# EAGLE design Swbot_shield (EAGLE 6.3)
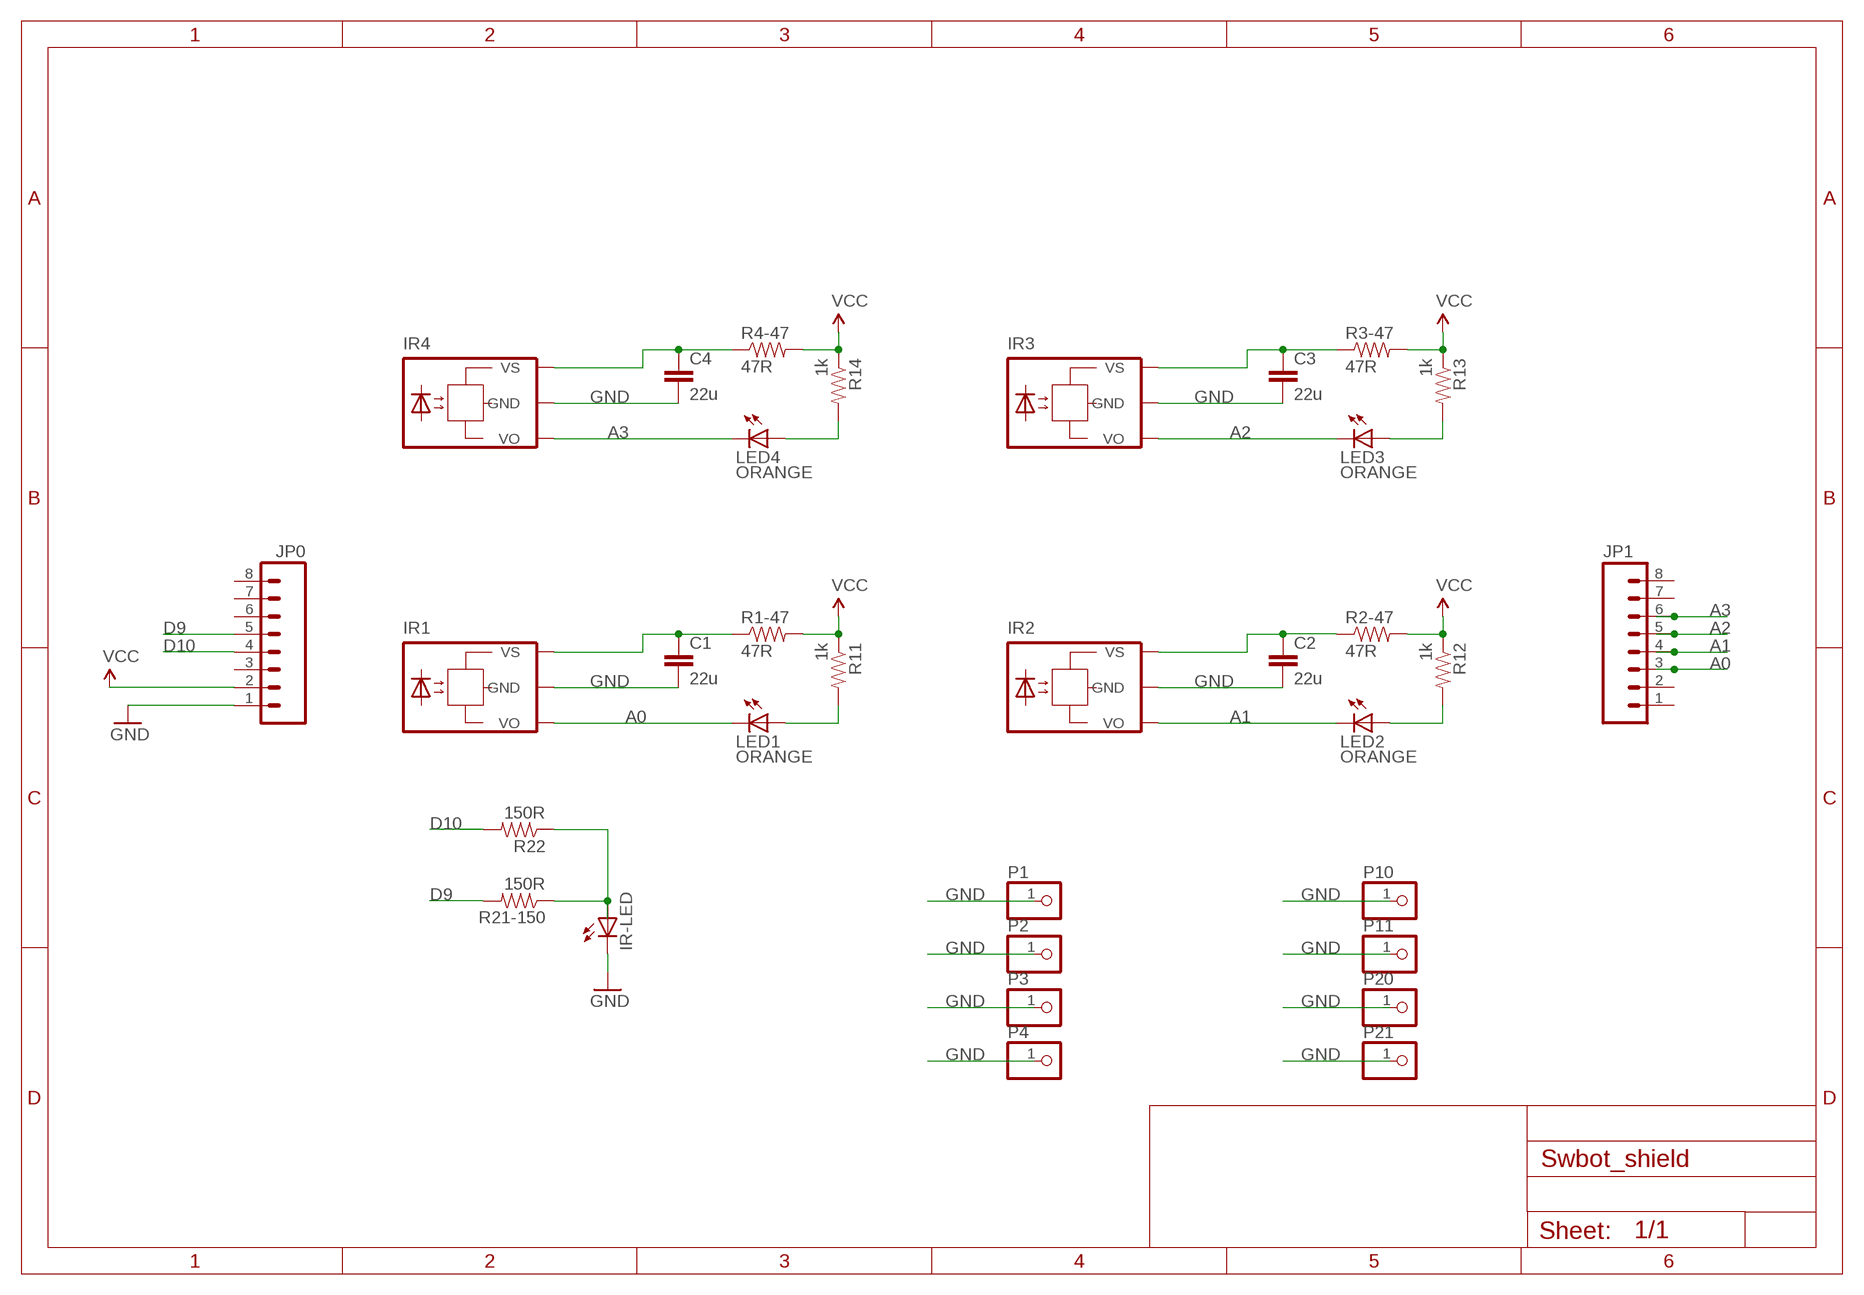
[diagram p0: schematic, sheet 1]

## Parts
C1  22u  CAP1206  [1206]
C2  22u  CAP1206  [1206]
C3  22u  CAP1206  [1206]
C4  22u  CAP1206  [1206]
IR1  -NJL  [TSOP]
IR2  -NJL  [TSOP]
IR3  -NJL  [TSOP]
IR4  -NJL  [TSOP]
IR-LED  LED5MM  [LED5MM]
JP0  M08LOCK  [1X08_LOCK]
JP1  M08LOCK  [1X08_LOCK]
LED1  ORANGE  LEDCHIPLED_0805  [CHIPLED_0805]
LED2  ORANGE  LEDCHIPLED_0805  [CHIPLED_0805]
LED3  ORANGE  LEDCHIPLED_0805  [CHIPLED_0805]
LED4  ORANGE  LEDCHIPLED_0805  [CHIPLED_0805]
P1  PINHD-1X1  [1X01]
P2  PINHD-1X1  [1X01]
P3  PINHD-1X1  [1X01]
P4  PINHD-1X1  [1X01]
P10  PINHD-1X1  [1X01]
P11  PINHD-1X1  [1X01]
P20  PINHD-1X1  [1X01]
P21  PINHD-1X1  [1X01]
R1-47  47R  RESISTOR0805-RES  [0805]
R2-47  47R  RESISTOR0805-RES  [0805]
R3-47  47R  RESISTOR0805-RES  [0805]
R4-47  47R  RESISTOR0805-RES  [0805]
R11  1k  RESISTOR0805-RES  [0805]
R12  1k  RESISTOR0805-RES  [0805]
R13  1k  RESISTOR0805-RES  [0805]
R14  1k  RESISTOR0805-RES  [0805]
R21-150  150R  RESISTOR0805-RES  [0805]
R22  150R  RESISTOR0805-RES  [0805]

## Nets
A0: IR1.VO JP1.3 LED1.C
A1: IR2.VO JP1.4 LED2.C
A2: IR3.VO JP1.5 LED3.C
A3: IR4.VO JP1.6 LED4.C
D9: JP0.5 R21-150.2
D10: JP0.4 R22.2
GND [vcc]: C1.2 C2.2 C3.2 C4.2 IR1.GND IR2.GND IR3.GND IR4.GND IR-LED.K(C) JP0.1 P1.1 P2.1 P3.1 P4.1 P10.1 P11.1 P20.1 P21.1
N$1: LED1.A R11.2
N$2: IR-LED.A R21-150.1 R22.1
N$4: LED2.A R12.2
N$6: LED3.A R13.2
N$7 [vcc]: C2.1 IR2.VCC(VS) R2-47.1
N$8: LED4.A R14.2
N$9 [vcc]: C4.1 IR4.VCC(VS) R4-47.1
N$10 [vcc]: C3.1 IR3.VCC(VS) R3-47.1
N$11 [vcc]: C1.1 IR1.VCC(VS) R1-47.1
VCC [vcc]: JP0.2 R1-47.2 R2-47.2 R3-47.2 R4-47.2 R11.1 R12.1 R13.1 R14.1
Unconnected: JP0.3 JP0.6 JP0.7 JP0.8 JP1.1 JP1.2 JP1.7 JP1.8

## Library data of the parts
C1-C4 = SparkFun-Passives:CAP: Capacitor Standard 0603 ceramic capacitor, and 0.1" leaded capacitor.
IR1-IR4 = LeoBuild:?-NJL*
IR-LED = SparkFun-LED:LED: LEDs Standard schematic elements and footprints for 5mm, 3mm, 1206, and 0603 sized LEDs. 5mm - Spark Fun Electronics SKU : COM-00529 (and others)
JP0 JP1 = SparkFun-Connectors:M08: Header 8 Standard 8-pin 0.1" header. Use with straight break away headers (SKU : PRT-00116), right angle break away headers (PRT-00553), swiss pins (PRT-00743), machine pins (PRT-00117), and female headers (PRT-00115).
LED1-LED4 = led:LED: LED OSRAM: - CHIPLED LG R971, LG N971, LY N971, LG Q971, LY Q971, LO R971, LY R971 LH N974, LH R974 LS Q976, LO Q976, LY Q976 LO Q996 - Hyper CHIPLED LW Q18S LB Q993, LB Q99A, LB R99A - SideLED LS A670, LO A670, LY A670, LG A670, LP A670 LB A673, LV A673, LT A673, LW A673 LH A674 LY A675 LS A676, LA A676, LO A676, LY A676, LW A676 LS A679, LY A679, LG A679 - Hyper Micro SIDELED® LS Y876, LA Y876, LO Y876, LY Y876 LT Y87S - SmartLED LW L88C, LW L88S LB L89C, LB L89S, LG L890 LS L89K, LO L89K, LY L89K LS L896, LA L896, LO L896, LY L896 - TOPLED LS T670, LO T670, LY T670, LG T670, LP T670 LSG T670, LSP T670, LSY T670, LOP T670, LYG T670 LG T671, LOG T671, LSG T671 LB T673, LV T673, LT T673, LW T673 LH T674 LS T676, LA T676, LO T676, LY T676, LB T676, LH T676, LSB T676, LW T676 LB T67C, LV T67C, LT T67C, LS T67K, LO T67K, LY T67K, LW E67C LS E67B, LA E67B, LO E67B, LY E67B, LB E67C, LV E67C, LT E67C LW T67C LS T679, LY T679, LG T679 LS T770, LO T770, LY T770, LG T770, LP T770 LB T773, LV T773, LT T773, LW T773 LH T774 LS E675, LA E675, LY E675, LS T675 LS T776, LA T776, LO T776, LY T776, LB T776 LHGB T686 LT T68C, LB T68C - Hyper Mini TOPLED® LB M676 - Mini TOPLED Santana® LG M470 LS M47K, LO M47K, LY M47K Source: http://www.osram.convergy.de LUXEON: - LUMILED® LXK2-PW12-R00, LXK2-PW12-S00, LXK2-PW14-U00, LXK2-PW14-V00 LXK2-PM12-R00, LXK2-PM12-S00, LXK2-PM14-U00 LXK2-PE12-Q00, LXK2-PE12-R00, LXK2-PE12-S00, LXK2-PE14-T00, LXK2-PE14-U00 LXK2-PB12-K00, LXK2-PB12-L00, LXK2-PB12-M00, LXK2-PB14-N00, LXK2-PB14-P00, LXK2-PB14-Q00 LXK2-PR12-L00, LXK2-PR12-M00, LXK2-PR14-Q00, LXK2-PR14-R00 LXK2-PD12-Q00, LXK2-PD12-R00, LXK2-PD12-S00 LXK2-PH12-R00, LXK2-PH12-S00 LXK2-PL12-P00, LXK2-PL12-Q00, LXK2-PL12-R00 Source: www.luxeon.com KINGBRIGHT: KA-3528ASYC Source: www.kingbright.com
P1-P4 P10 P11 P20 P21 = pinhead:PINHD-1X1: PIN HEADER
R1-47 R2-47 R3-47 R4-47 R11-R14 R21-150 R22 = SparkFun-Resistors:RESISTOR: Resistor Basic schematic elements and footprints for 0603, 1206, and PTH resistors.

## Net classes
0 default: width 0.254 mm
1 vcc: width 0.406 mm

## Board
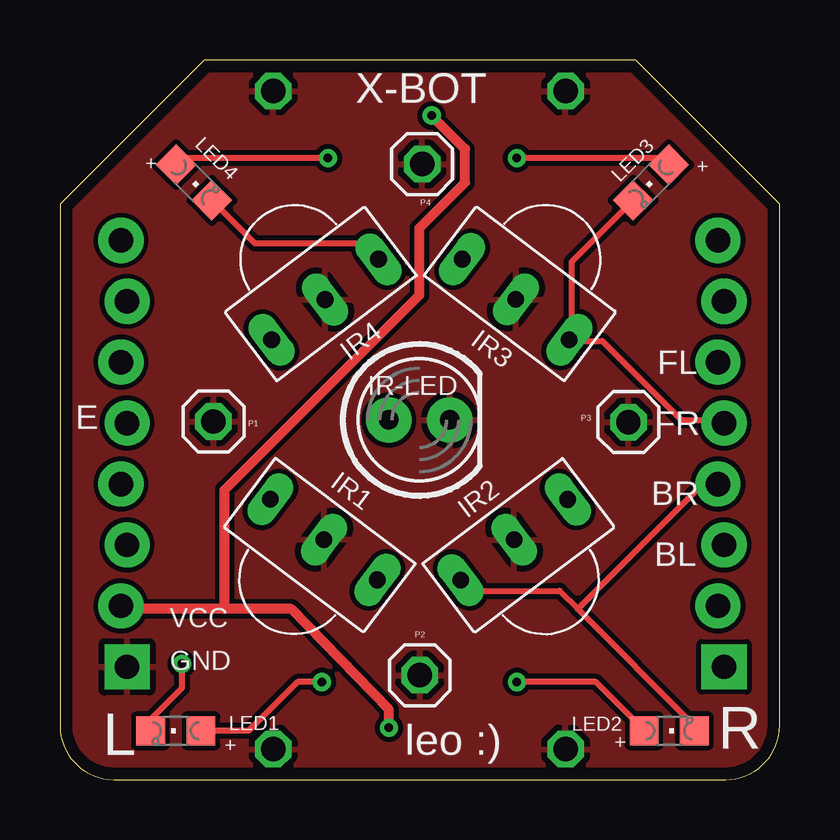
[diagram p1: board, top side]
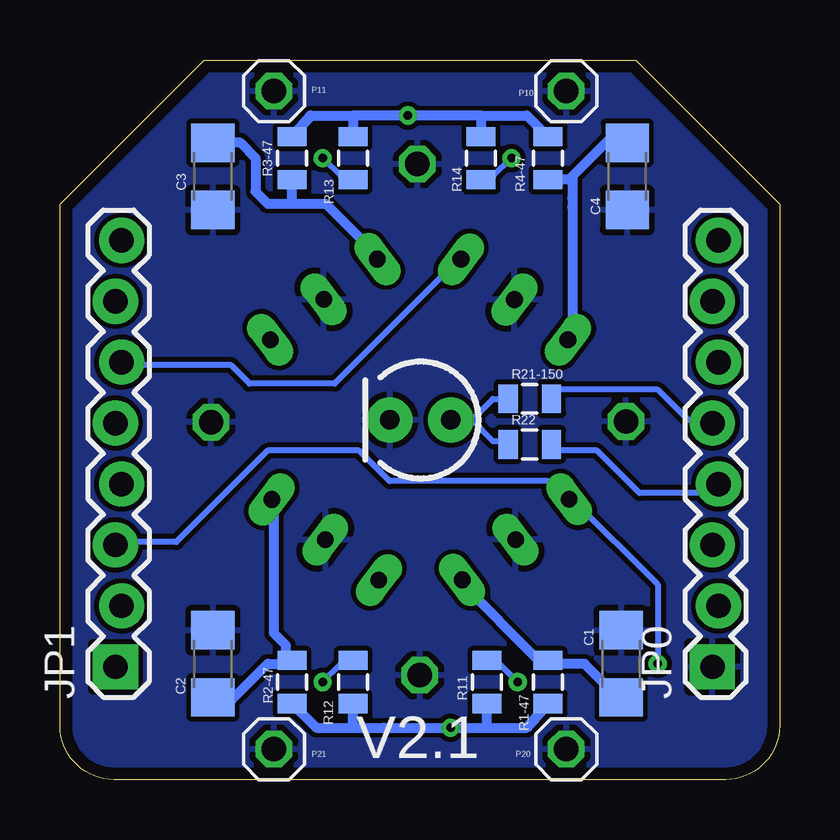
[diagram p2: board, bottom side, seen from below]

Size 30 x 30 mm. Coordinates in mm from the lower left corner, seen from the top.
Outline: 0,24 0,2.24 arc90 2.24,0 27.76,0 arc90 30,2.24 30,24 24,30 6,30 0,24
Copper layers (1*16): Top 0.035mm / dielectric 1.5mm / Bottom 0.035mm
Design rules "default *": minimum track width 10mil, minimum drill 12mil, track to track 8mil, track to pad 8mil, pad to pad 8mil, via to via 8mil, smd to smd 8mil, copper to edge 20mil, drill to drill 8mil, minimum pad ring 10mil, minimum via ring 8mil, stop-mask expansion 4mil, vias tented up to drill 0mil, thermal gap 10mil

### Footprints (pad centres in the part's own frame; a part is rotated, then mirrored left to right if it is on the bottom)
1206 = smd 1.6 x 1.8: 1 -1.4,0; 2 1.4,0
TSOP = drill 0.7 long: GND 0,2.54; VCC 2.794,2.54; VO -2.794,2.54
LED5MM = drill 0.813 pad 1.88: A -1.27,0; K 1.27,0
1X08_LOCK = drill 1.016 pad 1.88 square: 1 0,0.127 | drill 1.016 pad 1.88: 2 2.54,-0.127; 3 5.08,0.127; 4 7.62,-0.127; 5 10.16,0.127; 6 12.7,-0.127; 7 15.24,0.127; 8 17.78,-0.127
CHIPLED_0805 = smd 1.2 x 1.2: A 0,-1.05; C 0,1.05
1X01 = drill 1.016 octagon: 1 0,0
0805 = smd 0.8 x 1.2: 1 -0.9,0; 2 0.9,0

### Placement (x,y rotation side)
C1  6.6,4.83 90 bottom
C2  23.62,4.83 90 bottom
C3  23.62,25.15 270 bottom
C4  6.35,25.15 270 bottom
IR1  9.47,7.97 323 top
IR2  20.47,7.97 37 top
IR3  20.53,22.05 143 top
IR4  9.52,22.04 217 top
IR-LED  14.98,14.99 0 top
JP0  2.67,4.7 90 bottom
JP1  27.56,4.7 90 bottom
LED1  4.83,2.03 90 top
LED2  25.4,2.03 270 top
LED3  24.64,24.89 135 top
LED4  5.59,24.89 225 top
P1  6.4,14.93 0 top
P2  15,4.35 0 top
P3  23.7,14.9 0 top
P4  15.1,25.66 0 top
P10  8.89,28.7 0 bottom
P11  21.08,28.7 0 bottom
P20  8.89,1.27 0 bottom
P21  21.08,1.27 0 bottom
R1-47  9.65,4.06 270 bottom
R2-47  20.32,4.06 270 bottom
R3-47  20.32,25.91 90 bottom
R4-47  9.65,25.91 90 bottom
R11  12.19,4.06 90 bottom
R12  17.78,4.06 90 bottom
R13  17.78,25.91 270 bottom
R14  12.45,25.91 270 bottom
R21-150  10.41,15.88 0 bottom
R22  10.41,13.97 0 bottom

### Tracks (layer width: path | path; a pad name or v marks a point on that pad's centre or on a via)
A0  (via drill 0.36)
  Top 0.254: v5.08,4.83 5.08,3.81 3.81,2.54 3.81,2.03 LED1.C
  Bottom 0.254: v5.08,4.83 5.08,8.13 8.64,11.68 IR1.VO 8.89,11.68 9.65,12.45 16.26,12.45 17.53,13.72 21.34,13.72 25.15,9.91 27.69,9.91 JP1.3
A1
  Top 0.254: 21.59,7.11 20.83,7.87 17.02,7.87 16.76,8.13 IR2.VO | 21.59,7.11 26.42,2.29 26.42,2.03 LED2.C | 21.59,7.11 26.67,12.19 27.43,12.19 JP1.4
A2
  Top 0.254: LED3.C 23.88,24.13 21.34,21.59 21.34,18.54 IR3.VO 21.34,18.29 22.61,18.29 25.91,14.99 27.69,14.99 JP1.5
A3
  Top 0.254: LED4.C 6.35,24.13 8.13,22.35 12.7,22.35 13.21,21.84 IR4.VO
  Bottom 0.254: JP1.6 27.43,17.27 22.86,17.27 22.1,16.51 18.54,16.51 13.46,21.59 IR4.VO
D9
  Bottom 0.254: R21-150.2 9.53,16.26 5.08,16.26 3.81,14.99 2.79,14.99 JP0.5
D10
  Bottom 0.254: R22.2 9.4,13.72 7.62,13.72 5.84,11.94 2.79,11.94 2.54,12.19 JP0.4
GND
  pour Bottom: 0,30 30,30 30,0 0,0
  pour Top: 0,0 30,0 30,30 0,30
N$1  (via drill 0.36)
  Top 0.254: v10.92,4.06 9.91,4.06 7.87,2.03 6.1,2.03 LED1.A
  Bottom 0.254: v10.92,4.06 11.68,4.83 12.19,4.83 R11.2
N$2
  Bottom 0.254: R22.1 11.44,14.1 11.94,14.1 12.83,14.99 | 12.83,14.99 IR-LED.A | 12.83,14.99 11.95,15.88 R21-150.1
N$4  (via drill 0.36)
  Top 0.254: v19.05,4.06 22.35,4.06 24.38,2.03 LED2.A
  Bottom 0.254: v19.05,4.06 18.29,4.83 17.78,4.83 R12.2
N$6  (via drill 0.36)
  Top 0.254: v19.05,25.91 25.65,25.91 LED3.A
  Bottom 0.254: v19.05,25.91 18.29,25.15 17.78,25.15 R13.2
N$7
  Bottom 0.406: 20.57,4.83 21.34,4.83 22.86,3.3 23.62,3.3 C2.1 | 20.57,4.83 20.32,4.83 R2-47.1 20.57,4.83 | 20.57,4.83 20.57,5.59 21.08,6.1 21.08,11.43 IR2.VCC
N$8  (via drill 0.36)
  Top 0.254: v11.18,25.91 9.91,25.91 5.33,25.91 4.83,25.65 LED4.A
  Bottom 0.254: v11.18,25.91 11.94,25.15 12.45,25.15 R14.2
N$9
  Bottom 0.406: 8.64,25.02 8.64,25.15 7.11,26.67 6.35,26.67 C4.1 | 8.64,25.02 8.76,25.02 R4-47.1 8.64,25.02 | 8.64,25.02 8.64,24.26 8.64,23.88 8.64,19.05 IR4.VCC
N$10
  Bottom 0.406: 20.32,24 21.34,24 21.84,24.51 21.84,25.91 22.48,26.54 C3.1 | 20.32,24 R3-47.1 20.32,24 | 20.32,24 18.92,24 16.76,21.84 IR3.VCC
N$11
  Bottom 0.406: C1.1 6.6,3.3 8.13,4.83 9.65,4.83 R1-47.1 9.65,5.08 10.16,5.08 13.21,8.13 IR1.VCC
VCC  (via drill 0.36)
  Top 0.406: 6.86,7.11 9.65,7.11 13.72,2.92 v13.72,2.16 | 6.86,7.11 2.54,7.11 JP0.2 | 6.86,7.11 6.86,11.68 6.86,12.06 14.99,20.19 14.99,22.99 16.89,24.89 16.89,26.29 v15.49,27.69 15.43,27.75
  Bottom 0.406: 12.19,2.16 10.54,2.16 R1-47.2 | 12.19,2.16 R11.1 12.19,2.16 | 17.78,2.16 19.3,2.16 R2-47.2 | 17.78,2.16 R12.1 17.78,2.16 | 13.84,2.16 v13.72,2.16 13.84,2.16 | 13.84,2.16 12.19,2.16 | 13.84,2.16 14.99,2.16 16.51,2.16 17.78,2.16 | 17.78,27.69 19.56,27.69 R3-47.2 | 17.78,27.69 R13.1 17.78,27.69 | 12.45,27.69 10.54,27.69 R4-47.2 | 12.45,27.69 R14.1 12.45,27.69 | 12.45,27.69 v15.49,27.69 17.78,27.69

### Text on the board
tPlace: X-BOT | + | + | FL | E | FR | BR | BL | VCC | GND | leo :) | L | + | + | R
bPlace: V2.1